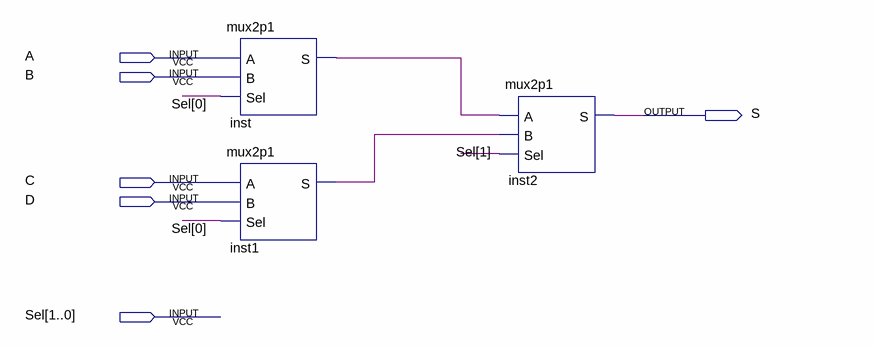
[diagram p0: schematic sheet]
// Quartus schematic mux4p1.bdf as structural Verilog: 3 symbols, 6 pins
module mux4p1 (
  input  A,
  input  B,
  input  C,
  input  D,
  input  [1:0] Sel,
  output S
);

  wire inst1_s, inst_s;

  mux2p1 inst (.A(A), .B(B), .Sel(Sel[0]), .S(inst_s));
  mux2p1 inst1 (.A(C), .B(D), .Sel(Sel[0]), .S(inst1_s));
  mux2p1 inst2 (.A(inst_s), .B(inst1_s), .Sel(Sel[1]), .S(S));
endmodule
